# EasyEDA schematic SCH_GPS_2026-03-24.json
TITLE: GPS TX; REV: 1.0; Date: 2026-03-18; Sheet: 1/1; Drawn By: karthikeyavarmachekuri247; Company: Karthikeya Varma Chekuri
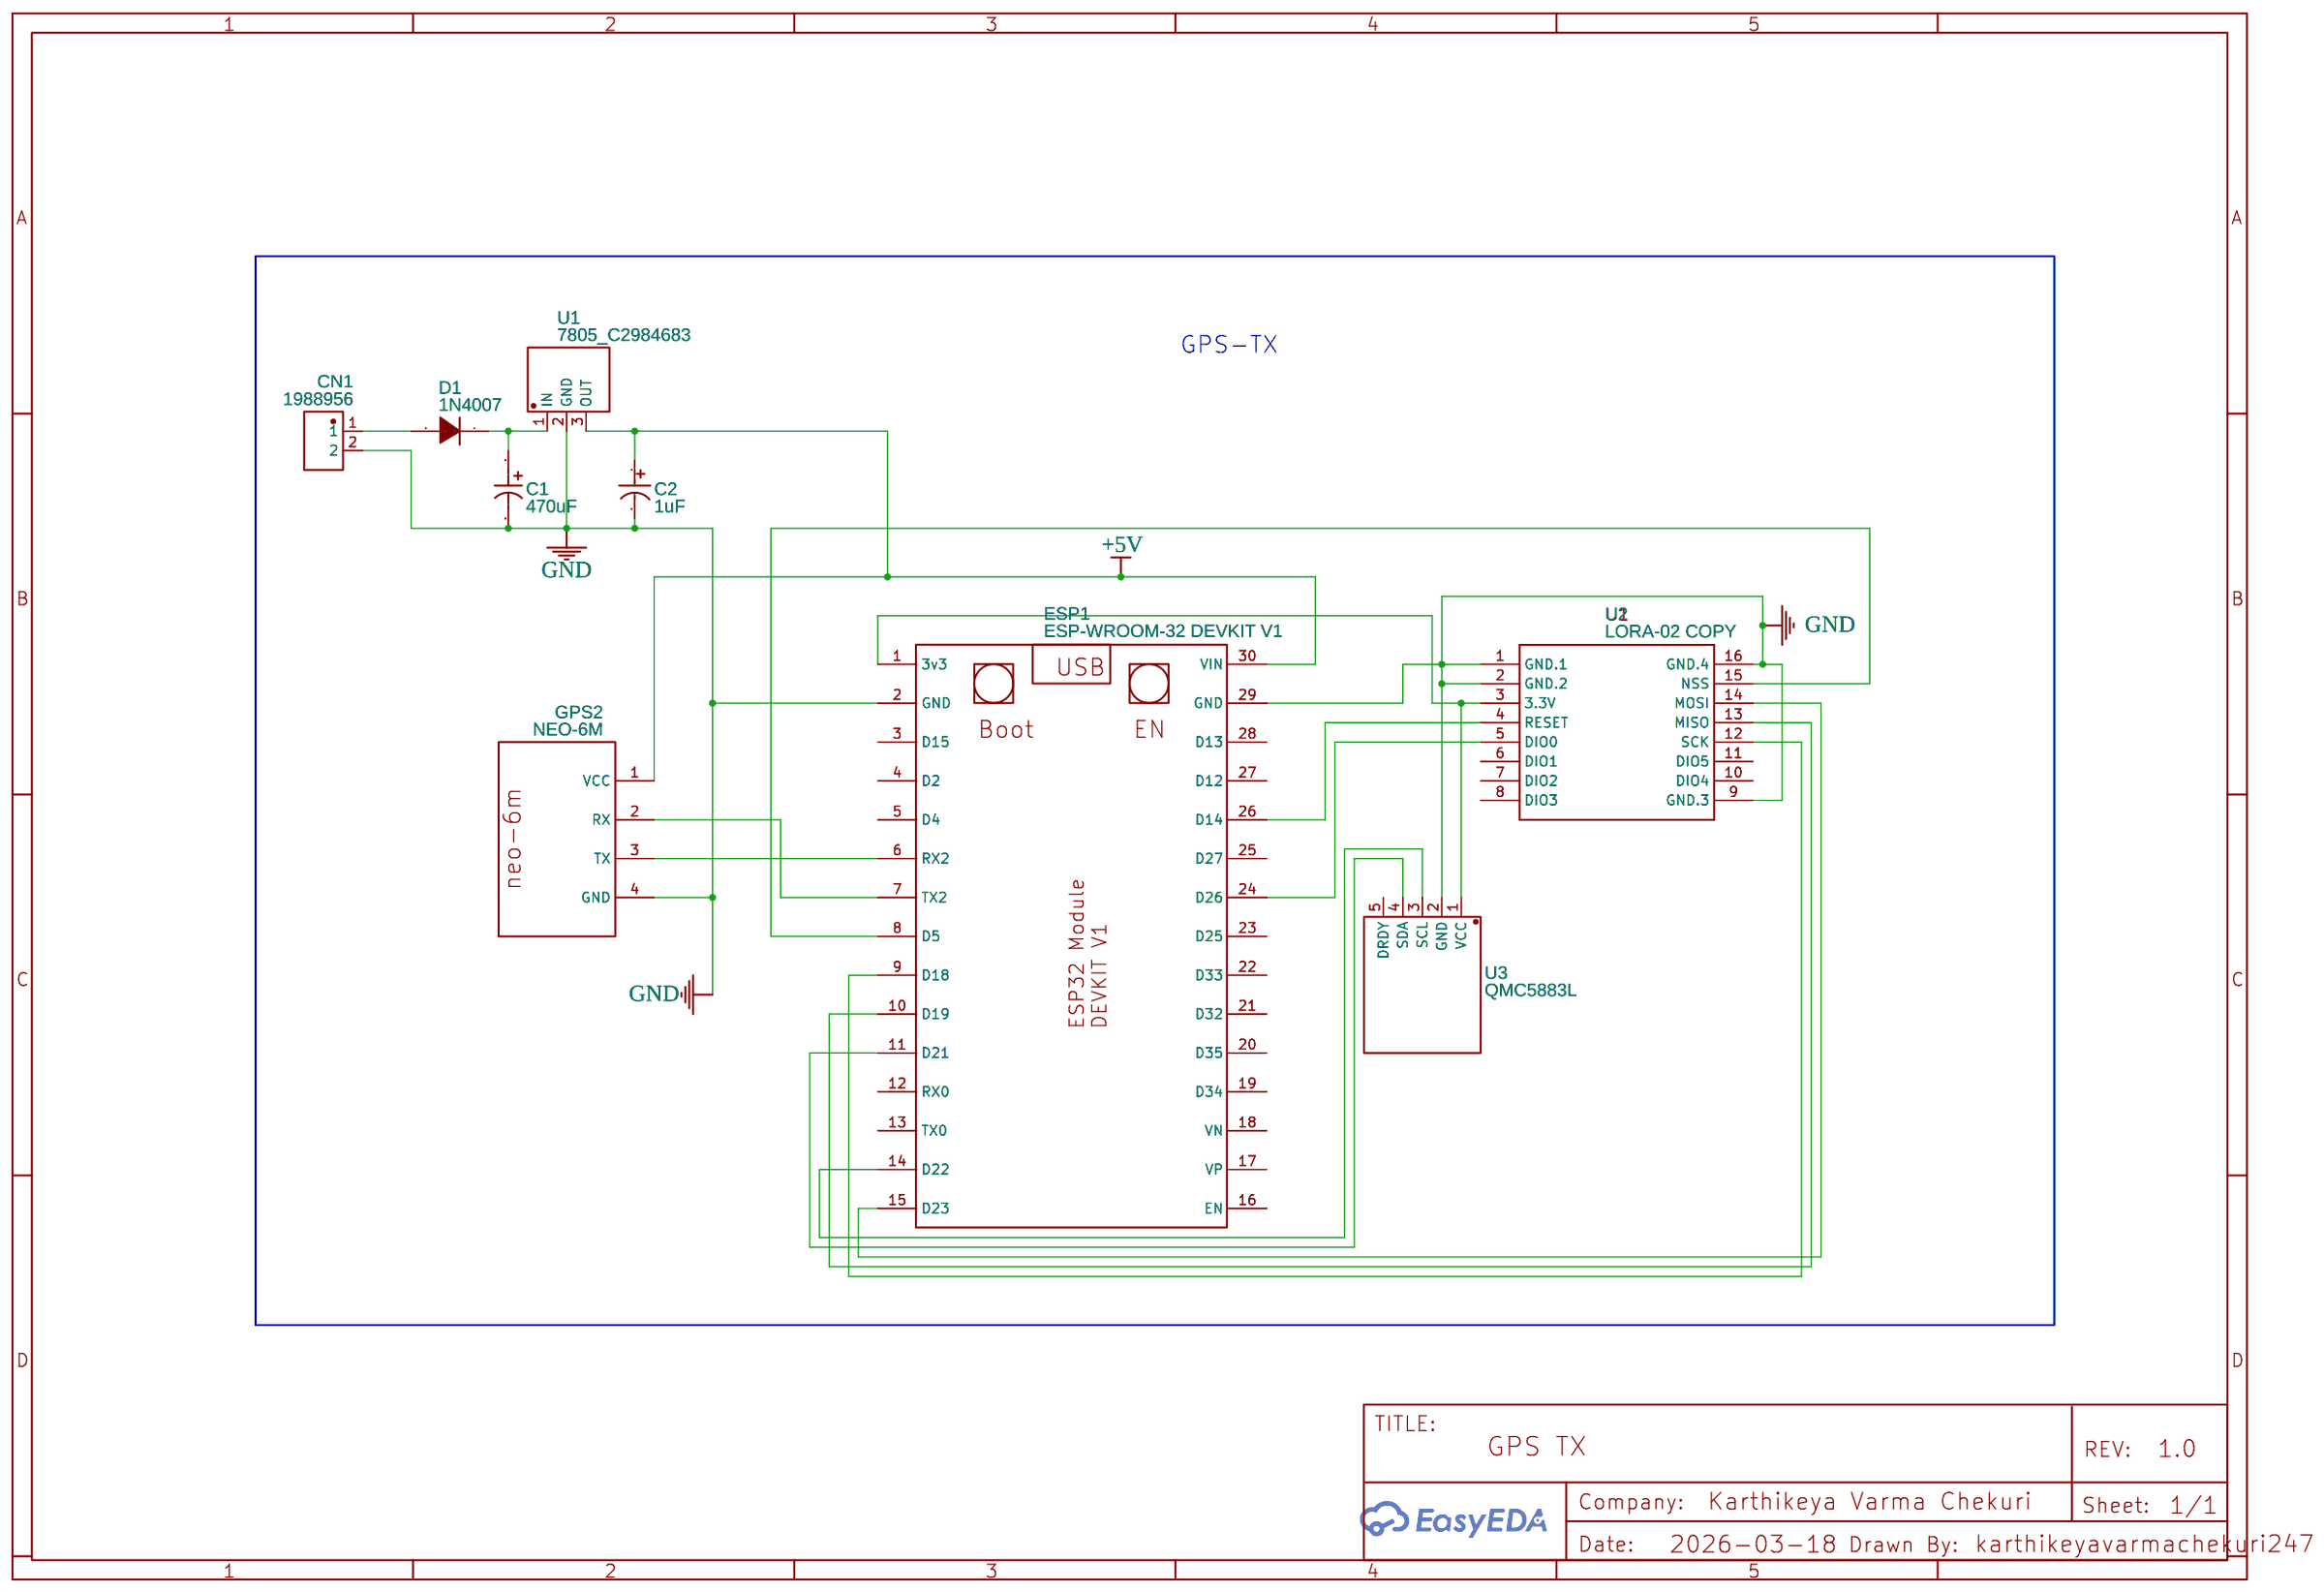
[diagram p0: schematic sheet]

## Parts
C1  470uF  [CAP-TH_BD8.0-P3.50-D0.5-FD_470UF25VF140KM]
C2  1uF  [CAP-TH_BD6.3-P2.50-D1.0-FD]
CN1  1988956  [COONN-TH_2P-L11.2-W7.0-P3.50_PHOENIX-CONTACT_1988956]
D1  1N4007  [DO-41_BD2.4-L4.7-P8.70-D0.9-RD]
ESP1  ESP-WROOM-32 DEVKIT V1  [ESP-WROOM-32 DEVKIT V1]
GPS2  NEO-6M  [NEO-6M]
U1  7805_C2984683  [TO-220-3_L10.0-W4.5-P2.54-L]
U2  LORA-02 COPY  [LORA-02]
U3  QMC5883L  [QMC5883L]

## Library data of the parts
C1 = 470UF25VF140KM: Supplier: LCSC; Supplier Part: C46867098; Manufacturer: Econd(米朗电子); Contributor: lcsc
C2 = 1uF 400V 6.3*12: Supplier: LCSC; Manufacturer: Chengx(承兴); Manufacturer Part: KM105M400E12RR0VH2FP0; Supplier Part: C46093; JLCPCB Part Class: Extended Part
CN1 = 1988956: Contributor: lcsc; Supplier: LCSC; Supplier Part: C3818165; Manufacturer: Phoenix Contact(菲尼克斯); JLCPCB Part Class: Extended Part
D1 = 1N4007: Supplier: LCSC; Manufacturer: ST(先科); Supplier Part: C106903; JLCPCB Part Class: Extended Part
ESP1 = ESP-WROOM-32 DEVKIT V1: Contributor: Zenmka; link: http://infoaleze.chez.com
GPS2 = NEO-6M: Contributor: Suhaimi Annuar
U1 = 7805_C2984683: Contributor: lcsc; Supplier: LCSC; Supplier Part: C2984683; Manufacturer: 集晶电子; Manufacturer Part: 7805; JLCPCB Part Class: Extended Part
U2 = LORA-02 COPY: link: https://www.elecrow.com/sx1278-lora-module-433m-10km-ra-02-wireless-spread-spectrum-transmission-socket-for-smart-home-diy.html; Contributor: Morningstar
U3 = QMC5883L: Supplier: LCSC; Contributor: dctemp100

## Nets
+5V: C2.1 ESP1.30(VIN) GPS2.1(VCC) U1.3(OUT)
GND: C1.2 C2.2 CN1.2 ESP1.2(GND) ESP1.29(GND) GPS2.4(GND) U1.2(GND) U2.1(GND.1) U2.2(GND.2) U2.9(GND.3) U2.16(GND.4) U3.2(GND)
Net-(C1-1): C1.1 D1.1(K) U1.1(IN)
Net-(CN1-1): CN1.1 D1.2(A)
Net-(ESP1-1): ESP1.1(3v3) U2.3(3.3V) U3.1(VCC)
Net-(ESP1-6): ESP1.6(RX2) GPS2.3(TX)
Net-(ESP1-7): ESP1.7(TX2) GPS2.2(RX)
Net-(ESP1-8): ESP1.8(D5) U2.15(NSS)
Net-(ESP1-9): ESP1.9(D18) U2.12(SCK)
Net-(ESP1-10): ESP1.10(D19) U2.13(MISO)
Net-(ESP1-11): ESP1.11(D21) U3.4(SDA)
Net-(ESP1-14): ESP1.14(D22) U3.3(SCL)
Net-(ESP1-15): ESP1.15(D23) U2.14(MOSI)
Net-(ESP1-24): ESP1.24(D26) U2.5(DIO0)
Net-(ESP1-26): ESP1.26(D14) U2.4(RESET)

Not connected (* = marked no-connect by the designer): ESP1 3(D15) 4(D2) 5(D4) 12(RX0) 13(TX0) 16(EN) 17(VP) 18(VN) 19(D34) 20(D35) 21(D32) 22(D33) 23(D25) 25(D27) 27(D12) 28(D13); U2 6(DIO1) 7(DIO2) 8(DIO3) 10(DIO4) 11(DIO5); U3 5(DRDY)

## Notes on the sheet
- GPS-TX
